# EAGLE schematic DRS_Paste_Mask (EAGLE 9.4.1)

## Sheet 1 of 4
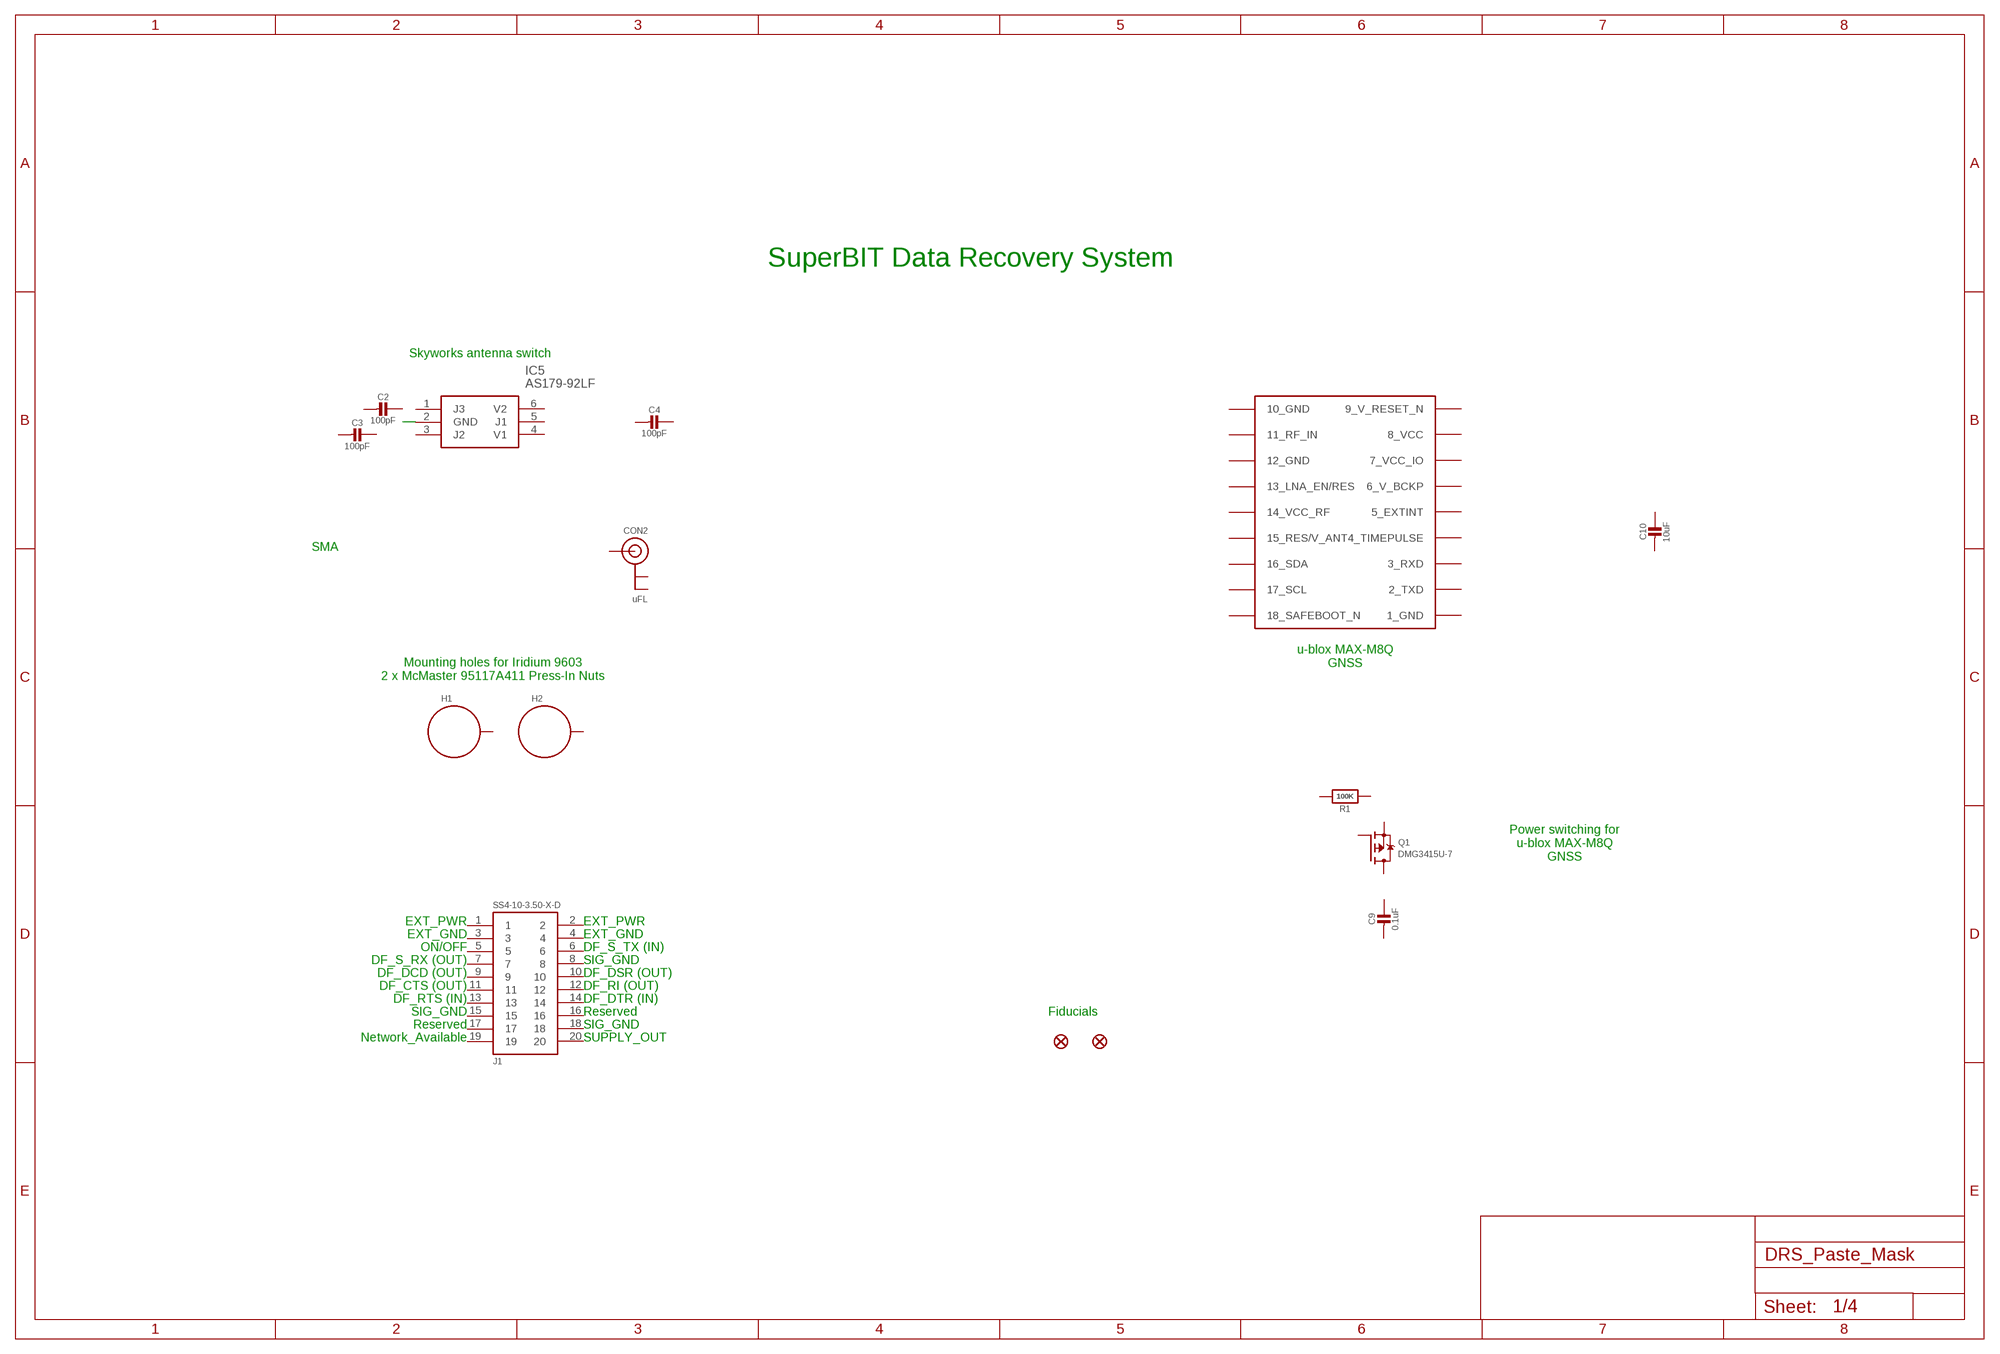
[diagram p0: schematic, sheet 1]

### Parts
C2  100pF  CAP_CERAMIC0603_NO  [0603-NO@1]
C3  100pF  CAP_CERAMIC0603_NO  [0603-NO@1]
C4  100pF  CAP_CERAMIC0603_NO  [0603-NO@1]
C9  0.1uF  CAP_CERAMIC0805-NOOUTLINE  [0805-NO@1]
C10  10uF  CAP_CERAMIC0805-NOOUTLINE  [0805-NO@1]
CON2  uFL  ANTENNA_U.FL  [U.FL]
FD1  FIDUCIAL1X2  [FIDUCIAL-1X2]
FD2  FIDUCIAL1X2  [FIDUCIAL-1X2]
H1  STANDOFF_ELECTRICALMCMASTER-95117A411  [STANDOFF-ELECTRICAL-MCMASTER-95117A411]
H2  STANDOFF_ELECTRICALMCMASTER-95117A411  [STANDOFF-ELECTRICAL-MCMASTER-95117A411]
IC5  AS179-92LF  [SOT65P220X100-6N]
IC6  MAX-M8  [MAX-M8]
J1  SS4-10-3.50-X-D  [SS4-10-3.50-X-D]
Q1  DMG3415U-7  MOSFET-PWIDE  [SOT23-WIDE]
R1  100K  RESISTOR0805_NOOUTLINE  [0805-NO]

### Nets
N$4: IC5.2(GND)
Unconnected: C2.1 C2.2 C3.1 C3.2 C4.1 C4.2 C9.1 C9.2 C10.1 C10.2 CON2.1(GND) CON2.2(GND) CON2.3(SIGNAL) H1.P1 H2.P1 IC5.1(J3) IC5.3(J2) IC5.4(V1) IC5.5(J1) IC5.6(V2) IC6.2_TXD IC6.3_RXD IC6.4_TIMEPULSE IC6.5_EXTINT IC6.6_V_BCKP IC6.11_RF_IN IC6.13_LNA_EN(13_LNA_EN/RES) IC6.14_VCC_RF IC6.15_V_ANT/RESERVED(15_RES/V_ANT) IC6.16_SDA IC6.17_SCL IC6.18_SAFEBOOT_N J1.1 J1.2 J1.3 J1.4 J1.5 J1.6 J1.7 J1.8 J1.9 J1.10 J1.11 J1.12 J1.13 J1.14 J1.15 J1.16 J1.17 J1.18 J1.19 J1.20 Q1.1(G) Q1.2(S) Q1.3(D) R1.1 R1.2

### Notes on the sheet
- SuperBIT Data Recovery System
- Skyworks antenna switch
- SMA
- u-blox MAX-M8Q
  GNSS
- Mounting holes for Iridium 9603
  2 x McMaster 95117A411 Press-In Nuts
- Power switching for
  u-blox MAX-M8Q
  GNSS
- EXT_PWR | EXT_PWR
- EXT_GND | EXT_GND
- ON/OFF | DF_S_TX (IN)
- DF_S_RX (OUT) | SIG_GND
- DF_DCD (OUT) | DF_DSR (OUT)
- DF_CTS (OUT) | DF_RI (OUT)
- DF_RTS (IN) | DF_DTR (IN)
- SIG_GND | Reserved | Fiducials
- Reserved | SIG_GND
- Network_Available | SUPPLY_OUT

## Sheet 2 of 4
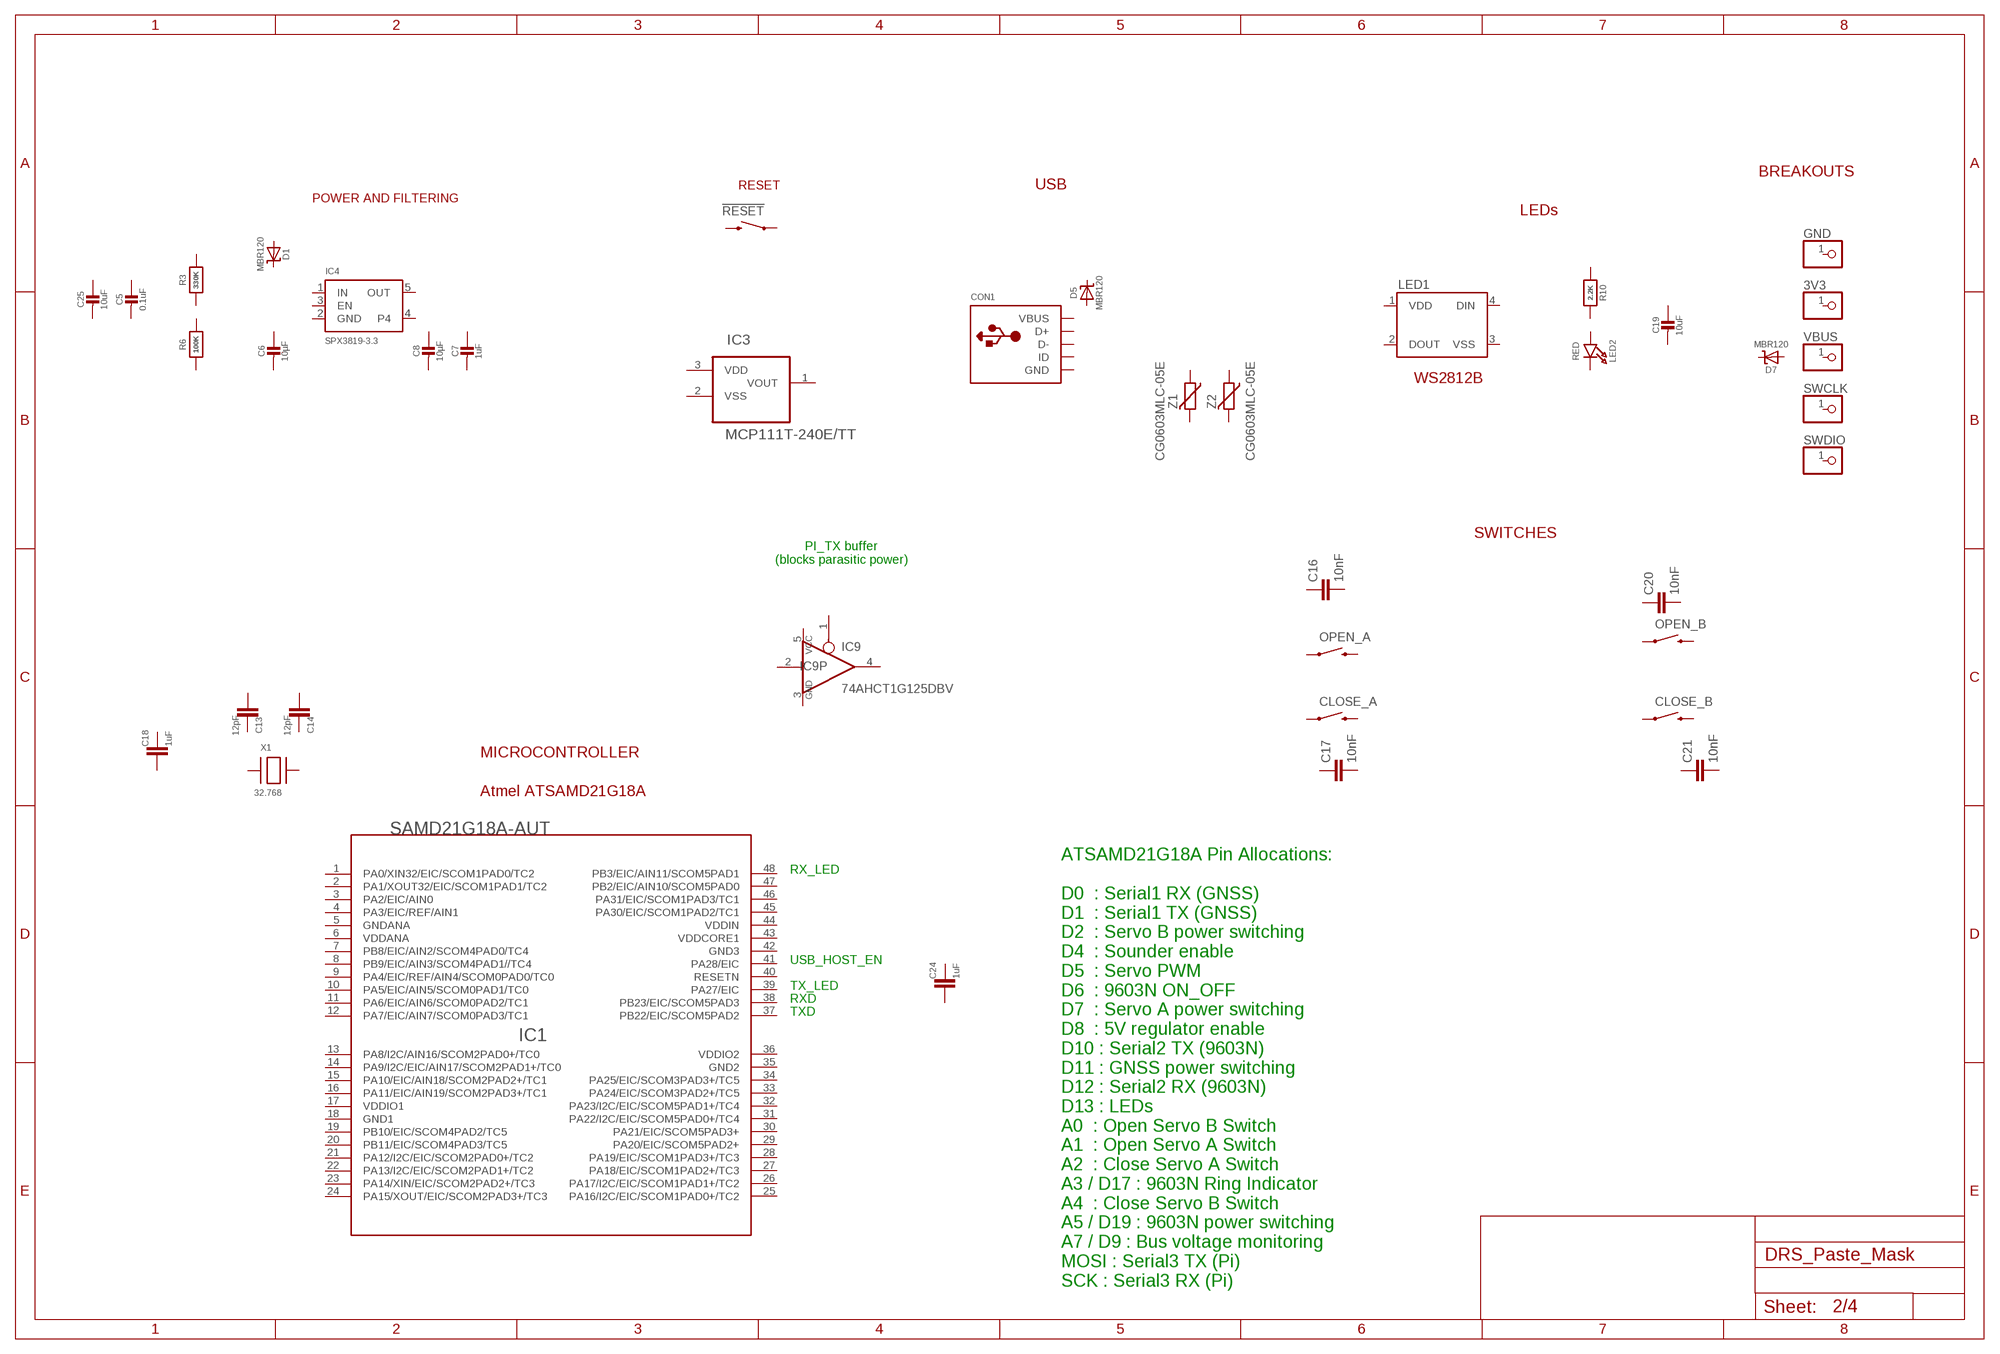
[diagram p1: schematic, sheet 2]

### Parts
3V3  PINHD-1X1  [1X01]
!RESET  SWITCH-MOMENTARY-2PTH  [TACTILE-PTH]
C5  0.1uF  CAP_CERAMIC0805-NOOUTLINE  [0805-NO@1]
C6  10µF  CAP_CERAMIC0805-NOOUTLINE  [0805-NO@1]
C7  1uF  CAP_CERAMIC0603_NO  [0603-NO@1]
C8  10µF  CAP_CERAMIC0805-NOOUTLINE  [0805-NO@1]
C13  12pF  C-EUC0603  [C0603]
C14  12pF  C-EUC0603  [C0603]
C16  10nF  C-EUC0805  [C0805]
C17  10nF  C-EUC0805  [C0805]
C18  1uF  C-EUC0603  [C0603]
C19  10uF  CAP_CERAMIC0805-NOOUTLINE  [0805-NO@1]
C20  10nF  C-EUC0805  [C0805]
C21  10nF  C-EUC0805  [C0805]
C24  1uF  C-EUC0603  [C0603]
C25  10uF  CAP_CERAMIC0805-NOOUTLINE  [0805-NO@1]
CLOSE_A  SWITCH-MOMENTARY-2PTH  [TACTILE-PTH]
CLOSE_B  SWITCH-MOMENTARY-2PTH  [TACTILE-PTH]
CON1  MICROBUILDER_USBFCI_10103594_CORRECTED  [MICROBUILDER_FCI_10103594_CORRECTED]
D1  MBR120  DIODE-SCHOTTKYSOD-123  [SOD-123]
D5  MBR120  DIODE-SCHOTTKYSOD-123  [SOD-123]
D7  MBR120  DIODE-SCHOTTKYSOD-123  [SOD-123]
GND  PINHD-1X1  [1X01]
IC1  SAMD21G18A-AUT  1792_SAMD21G18A-AUT  [TQFP48-7X7]
IC3  MCP111T-240E/TT  MCP111T-270E/TT  [SOT95P237X112-3N]
IC4  SPX3819-3.3  VREG_SOT23-5  [SOT23-5]
IC9  74AHCT1G125DBV  [SOT23-5]
LED1  WS2812B  [WS2812B]
LED2  RED  LED0805_NOOUTLINE  [CHIPLED_0805_NOOUTLINE]
OPEN_A  SWITCH-MOMENTARY-2PTH  [TACTILE-PTH]
OPEN_B  SWITCH-MOMENTARY-2PTH  [TACTILE-PTH]
R3  330K  RESISTOR0805_NOOUTLINE  [0805-NO]
R6  100K  RESISTOR0805_NOOUTLINE  [0805-NO]
R10  2.2K  RESISTOR_0603_NOOUT  [0603-NO]
SWCLK  PINHD-1X1  [1X01]
SWDIO  PINHD-1X1  [1X01]
VBUS  PINHD-1X1  [1X01]
X1  32.768  XTAL-3.2X1.5  [XTAL3215]
Z1  CG0603MLC-05E  0010_BRNCG0603MLC-05E  [CT/CN0603]
Z2  CG0603MLC-05E  0010_BRNCG0603MLC-05E  [CT/CN0603]
Unconnected: 3V3.1 !RESET.1 !RESET.3 C5.1 C5.2 C6.1 C6.2 C7.1 C7.2 C8.1 C8.2 C13.1 C13.2 C14.1 C14.2 C16.1 C16.2 C17.1 C17.2 C18.1 C18.2 C19.1 C19.2 C20.1 C20.2 C21.1 C21.2 C24.1 C24.2 C25.1 C25.2 CLOSE_A.1 CLOSE_A.3 CLOSE_B.1 CLOSE_B.3 CON1.D+ CON1.D- CON1.ID D1.A D1.C D5.A D5.C D7.A D7.C GND.1 IC1.1(PA0/XIN32/EIC/SCOM1PAD0/TC2) IC1.2(PA1/XOUT32/EIC/SCOM1PAD1/TC2) IC1.3(PA2/EIC/AIN0) IC1.4(PA3/EIC/REF/AIN1) IC1.7(PB8/EIC/AIN2/SCOM4PAD0/TC4) IC1.8(PB9/EIC/AIN3/SCOM4PAD1//TC4) IC1.9(PA4/EIC/REF/AIN4/SCOM0PAD0/TC0) IC1.10(PA5/EIC/AIN5/SCOM0PAD1/TC0) IC1.11(PA6/EIC/AIN6/SCOM0PAD2/TC1) IC1.12(PA7/EIC/AIN7/SCOM0PAD3/TC1) IC1.13(PA8/I2C/AIN16/SCOM2PAD0+/TC0) IC1.14(PA9/I2C/EIC/AIN17/SCOM2PAD1+/TC0) IC1.15(PA10/EIC/AIN18/SCOM2PAD2+/TC1) IC1.16(PA11/EIC/AIN19/SCOM2PAD3+/TC1) IC1.19(PB10/EIC/SCOM4PAD2/TC5) IC1.20(PB11/EIC/SCOM4PAD3/TC5) IC1.21(PA12/I2C/EIC/SCOM2PAD0+/TC2) IC1.22(PA13/I2C/EIC/SCOM2PAD1+/TC2) IC1.23(PA14/XIN/EIC/SCOM2PAD2+/TC3) IC1.24(PA15/XOUT/EIC/SCOM2PAD3+/TC3) IC1.25(PA16/I2C/EIC/SCOM1PAD0+/TC2) IC1.26(PA17/I2C/EIC/SCOM1PAD1+/TC2) IC1.27(PA18/EIC/SCOM1PAD2+/TC3) IC1.28(PA19/EIC/SCOM1PAD3+/TC3) IC1.29(PA20/EIC/SCOM5PAD2+) IC1.30(PA21/EIC/SCOM5PAD3+) IC1.31(PA22/I2C/EIC/SCOM5PAD0+/TC4) IC1.32(PA23/I2C/EIC/SCOM5PAD1+/TC4) IC1.33(PA24/EIC/SCOM3PAD2+/TC5) IC1.34(PA25/EIC/SCOM3PAD3+/TC5) IC1.37(PB22/EIC/SCOM5PAD2) IC1.38(PB23/EIC/SCOM5PAD3) IC1.39(PA27/EIC) IC1.40(RESETN) IC1.41(PA28/EIC) IC1.43(VDDCORE1) IC1.45(PA30/EIC/SCOM1PAD2/TC1) IC1.46(PA31/EIC/SCOM1PAD3/TC1) IC1.47(PB2/EIC/AIN10/SCOM5PAD0) IC1.48(PB3/EIC/AIN11/SCOM5PAD1) IC3.1(VOUT) IC4.3(EN) IC4.4 IC4.5(OUT) IC9.1(OE) IC9.2(I) IC9.4(O) LED1.2(DOUT) LED1.4(DIN) LED2.A LED2.C OPEN_A.1 OPEN_A.3 OPEN_B.1 OPEN_B.3 R3.1 R3.2 R6.1 R6.2 R10.1 R10.2 SWCLK.1 SWDIO.1 VBUS.1 X1.P$1 X1.P$2 Z1.1 Z1.2 Z2.1 Z2.2

### Notes on the sheet
- BREAKOUTS
- RESET | USB
- POWER AND FILTERING
- LEDs
- WS2812B
- SWITCHES
- PI_TX buffer
  (blocks parasitic power)
- MICROCONTROLLER
- Atmel ATSAMD21G18A
- ATSAMD21G18A Pin Allocations:
  
  D0  : Serial1 RX (GNSS)
  D1  : Serial1 TX (GNSS)
  D2  : Servo B power switching
  D4  : Sounder enable
  D5  : Servo PWM
  D6  : 9603N ON_OFF
  D7  : Servo A power switching
  D8  : 5V regulator enable
  D10 : Serial2 TX (9603N)
  D11 : GNSS power switching
  D12 : Serial2 RX (9603N)
  D13 : LEDs
  A0  : Open Servo B Switch
  A1  : Open Servo A Switch
  A2  : Close Servo A Switch
  A3 / D17 : 9603N Ring Indicator
  A4  : Close Servo B Switch
  A5 / D19 : 9603N power switching
  A7 / D9 : Bus voltage monitoring
  MOSI : Serial3 TX (Pi)
  SCK : Serial3 RX (Pi)
- RX_LED
- USB_HOST_EN
- TX_LED
- RXD
- TXD

## Sheet 3 of 4
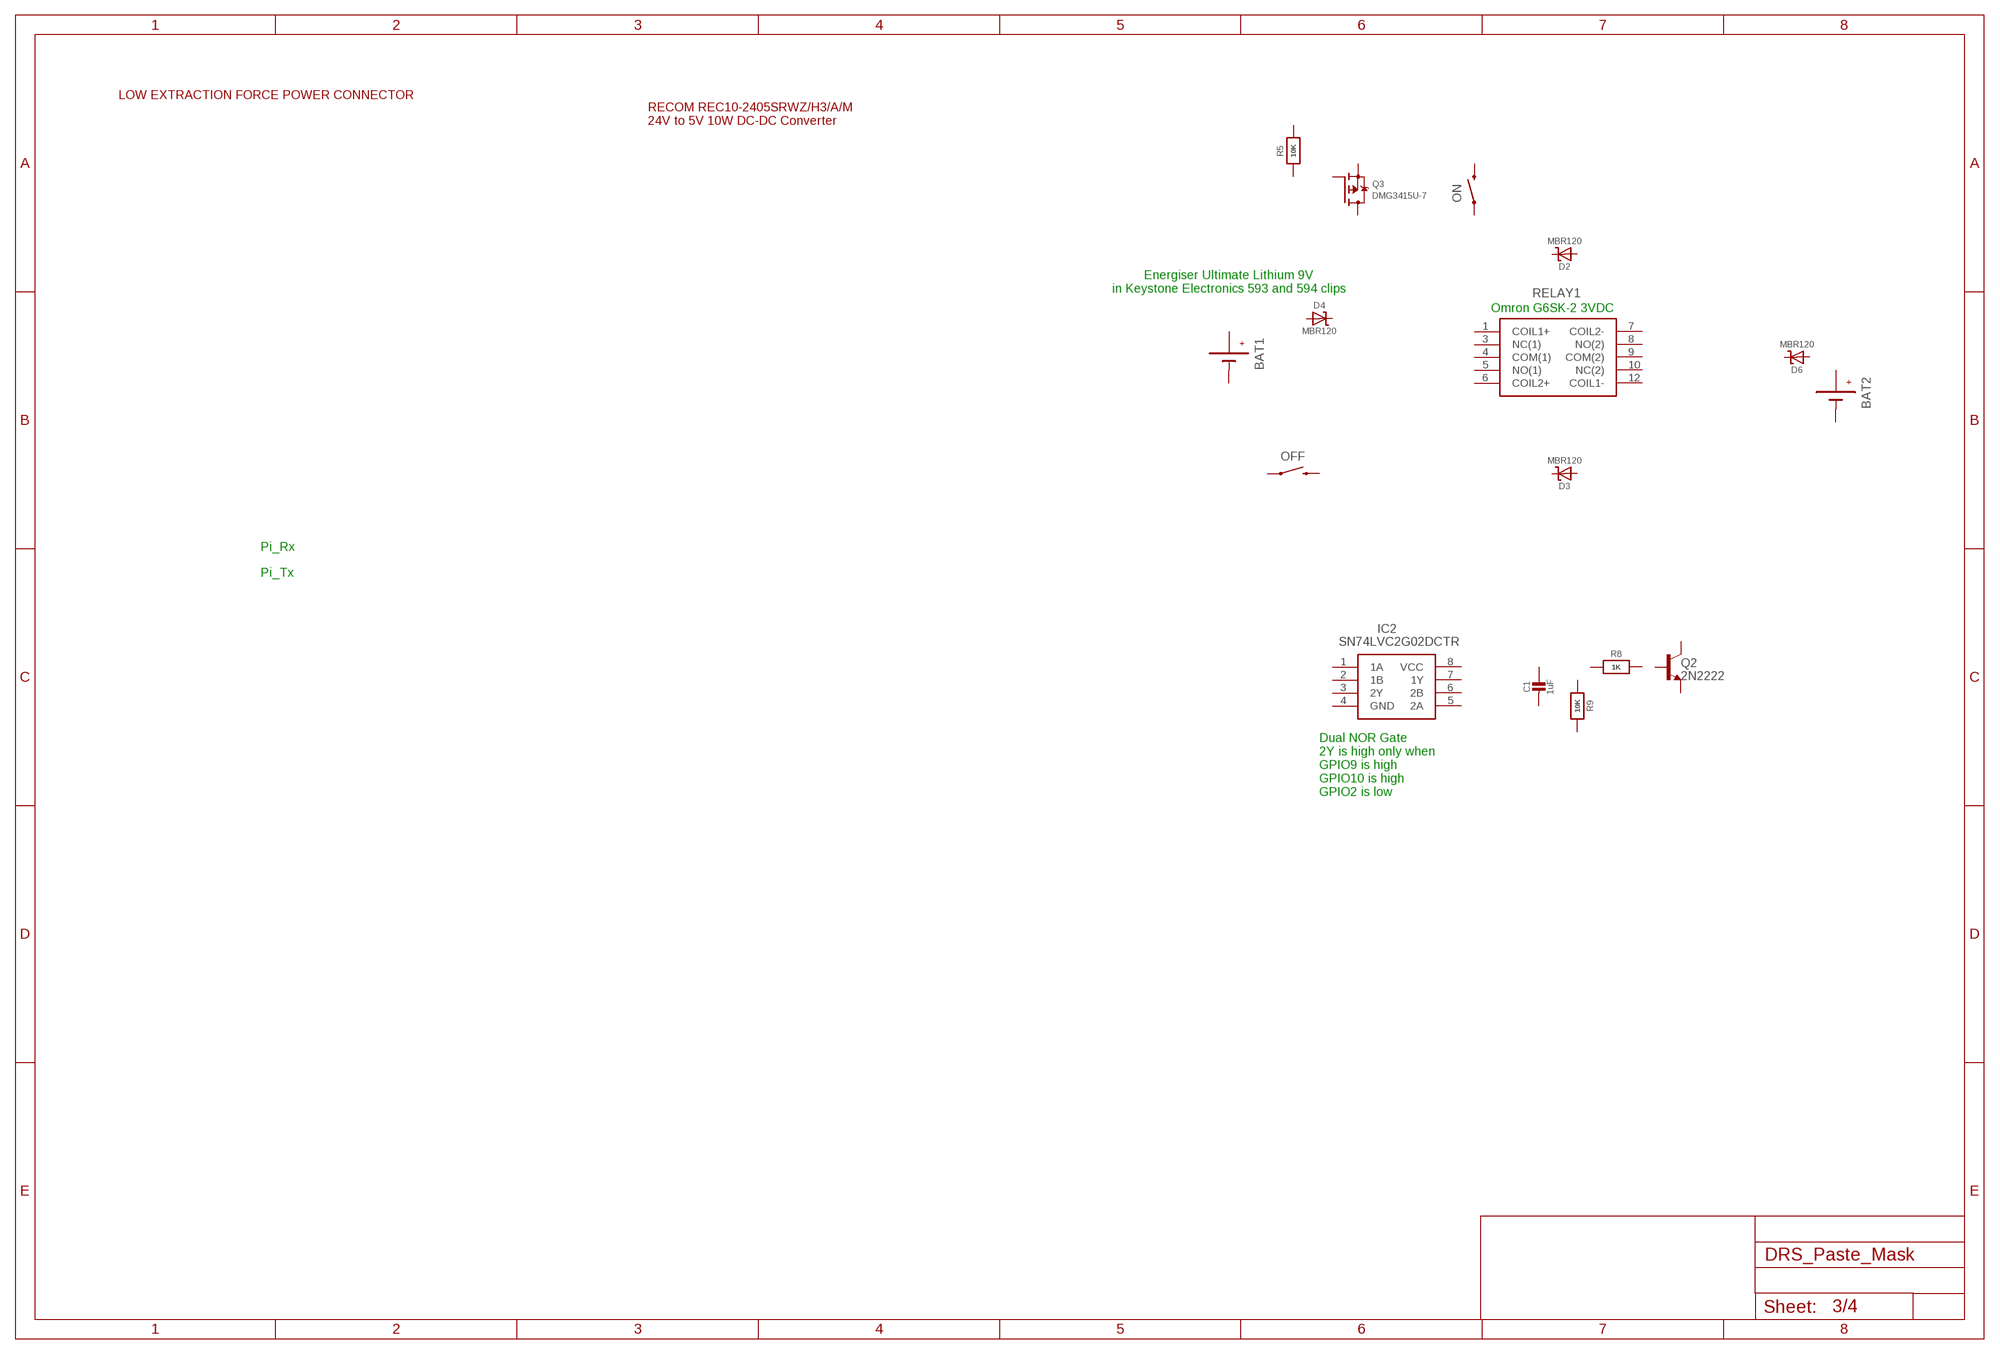
[diagram p2: schematic, sheet 3]

### Parts
BAT1  BATTERYBATTERY-9V-KEYSTONE-593-594  [BATTERY-9V-KEYSTONE-593-594]
BAT2  BATTERYBATTERY-9V-KEYSTONE-593-594  [BATTERY-9V-KEYSTONE-593-594]
C1  1uF  CAP_CERAMIC0603_NO  [0603-NO@1]
D2  MBR120  DIODE-SCHOTTKYSOD-123  [SOD-123]
D3  MBR120  DIODE-SCHOTTKYSOD-123  [SOD-123]
D4  MBR120  DIODE-SCHOTTKYSOD-123  [SOD-123]
D6  MBR120  DIODE-SCHOTTKYSOD-123  [SOD-123]
IC2  SN74LVC2G02DCTR  [SOP65P400X130-8N]
OFF  SWITCH-MOMENTARY-2PTH  [TACTILE-PTH]
ON  SWITCH-MOMENTARY-2PTH  [TACTILE-PTH]
Q2  2N2222  MMBT2222ALT1-NPN-SOT23-BEC  [SOT23-BEC]
Q3  DMG3415U-7  MOSFET-PWIDE  [SOT23-WIDE]
R5  10K  RESISTOR0805_NOOUTLINE  [0805-NO]
R8  1K  RESISTOR_0603_NOOUT  [0603-NO]
R9  10K  RESISTOR_0603_NOOUT  [0603-NO]
RELAY1  G6SK-2_DC5  [G6SK2DC5]
Unconnected: C1.1 C1.2 D2.A D2.C D3.A D3.C D4.A D4.C D6.A D6.C IC2.1(1A) IC2.2(1B) IC2.3(2Y) IC2.4(GND) IC2.5(2A) IC2.6(2B) IC2.7(1Y) IC2.8(VCC) OFF.1 OFF.3 ON.1 ON.3 Q2.B Q2.C Q2.E Q3.1(G) Q3.2(S) Q3.3(D) R5.1 R5.2 R8.1 R8.2 R9.1 R9.2 RELAY1.1(COIL1+) RELAY1.3(NC(1)) RELAY1.4(COM(1)) RELAY1.5(NO(1)) RELAY1.6(COIL2+) RELAY1.7(COIL2-) RELAY1.8(NO(2)) RELAY1.9(COM(2)) RELAY1.10(NC(2)) RELAY1.12(COIL1-)

### Notes on the sheet
- LOW EXTRACTION FORCE POWER CONNECTOR
- RECOM REC10-2405SRWZ/H3/A/M
  24V to 5V 10W DC-DC Converter
- Energiser Ultimate Lithium 9V
  in Keystone Electronics 593 and 594 clips
- Omron G6SK-2 3VDC
- Pi_Rx
- Pi_Tx
- Dual NOR Gate
  2Y is high only when
  GPIO9 is high
  GPIO10 is high
  GPIO2 is low

## Sheet 4 of 4
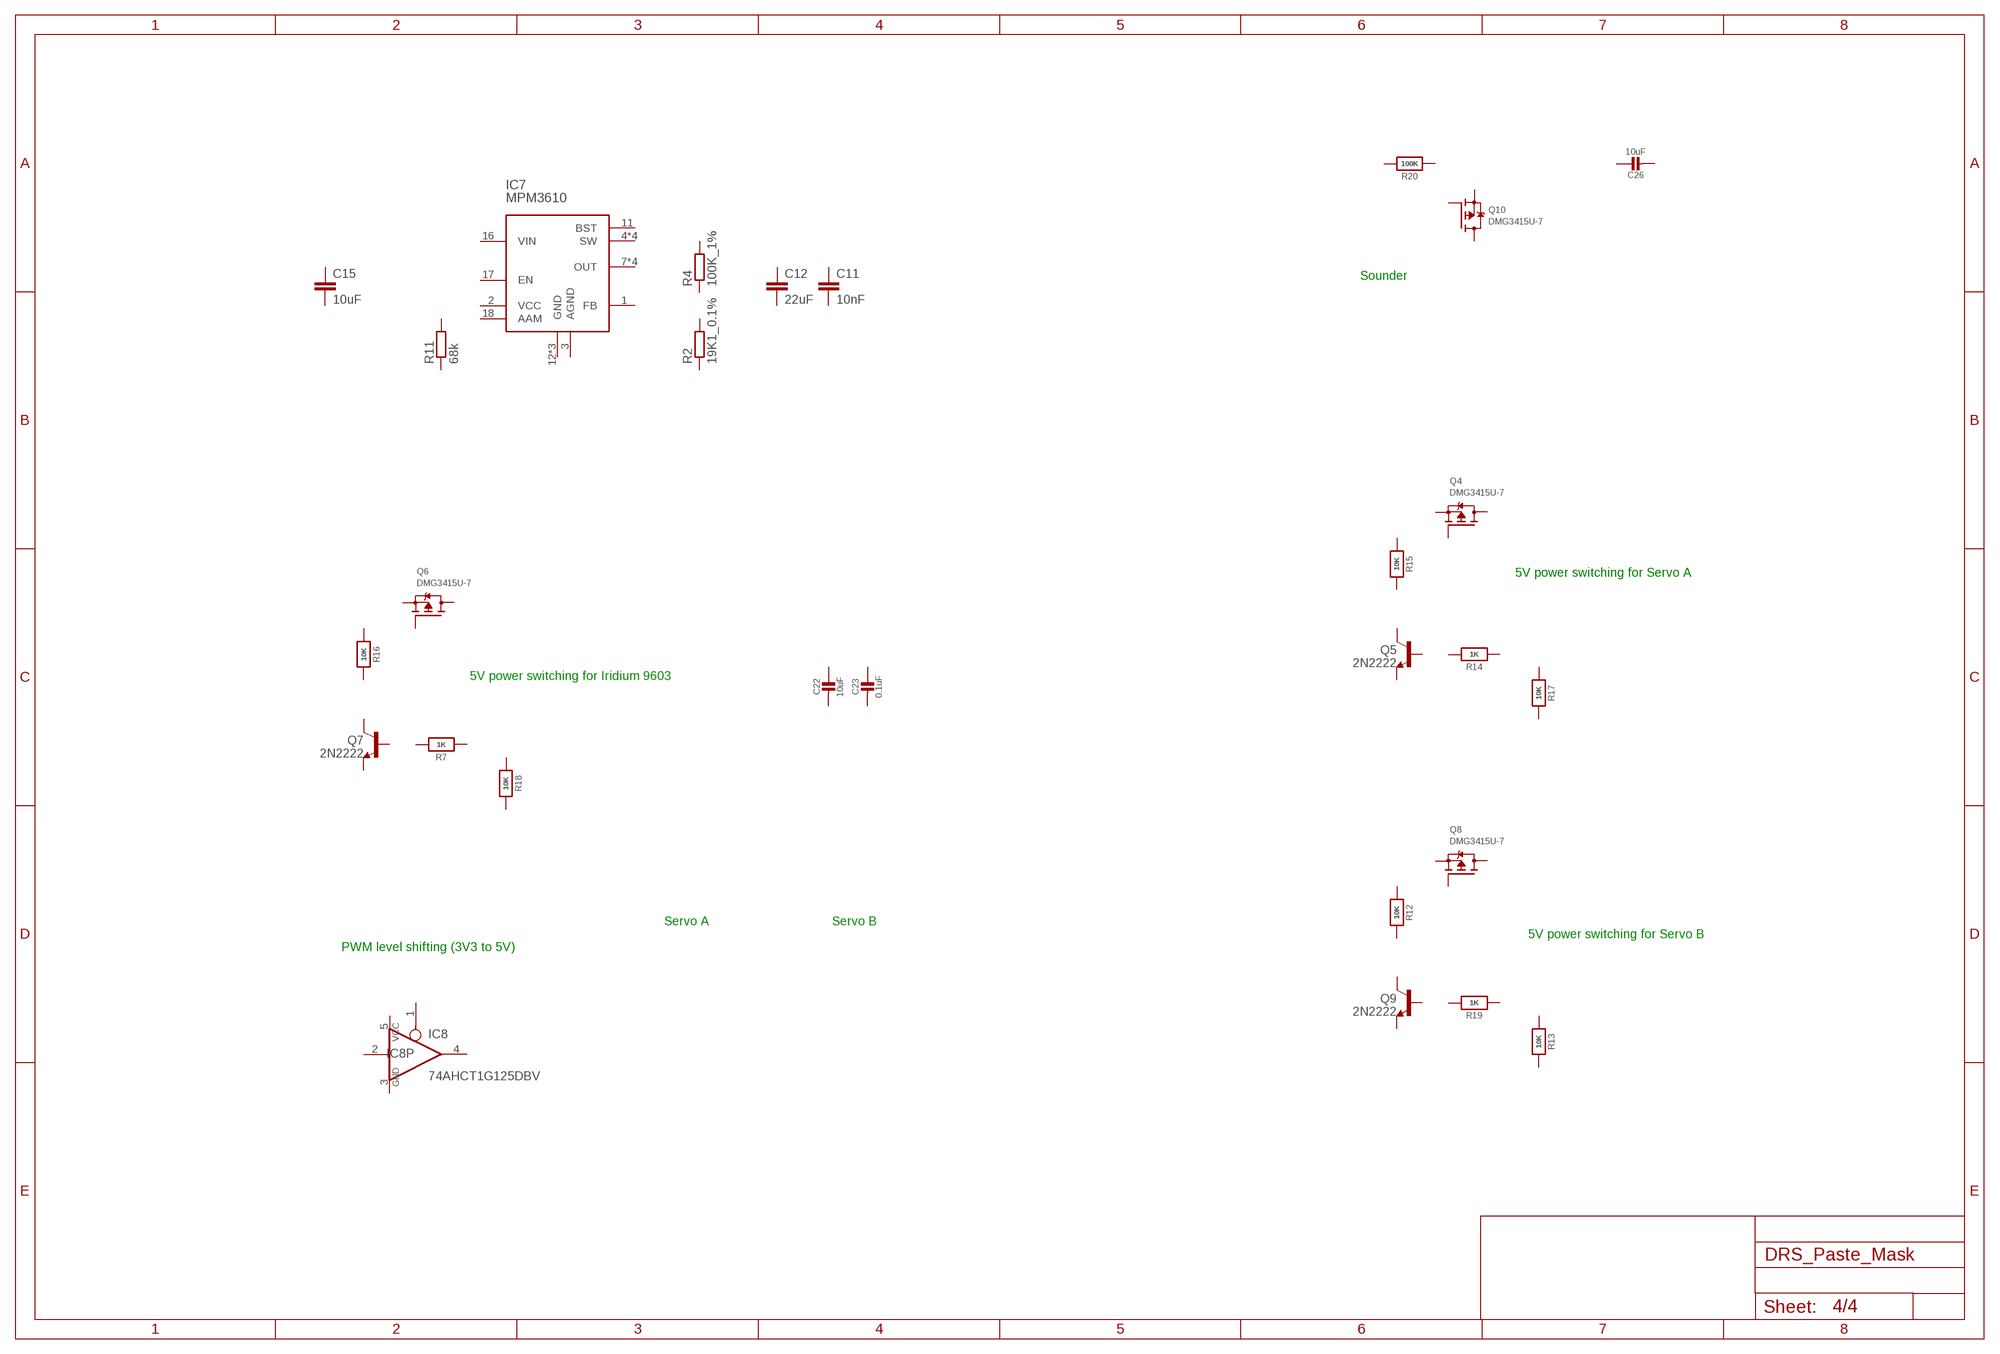
[diagram p3: schematic, sheet 4]

### Parts
C11  10nF  C-EUC0805  [C0805]
C12  22uF  C-EUC0805  [C0805]
C15  10uF  C-EUC0805  [C0805]
C22  10uF  CAP_CERAMIC0805-NOOUTLINE  [0805-NO@1]
C23  0.1uF  CAP_CERAMIC0805-NOOUTLINE  [0805-NO@1]
C26  10uF  CAP_CERAMIC0805-NOOUTLINE  [0805-NO@1]
IC7  MPM3610  2093_MPM3610GQV-P  [QFN-20]
IC8  74AHCT1G125DBV  [SOT23-5]
Q4  DMG3415U-7  MOSFET-PWIDE  [SOT23-WIDE]
Q5  2N2222  MMBT2222ALT1-NPN-SOT23-BEC  [SOT23-BEC]
Q6  DMG3415U-7  MOSFET-PWIDE  [SOT23-WIDE]
Q7  2N2222  MMBT2222ALT1-NPN-SOT23-BEC  [SOT23-BEC]
Q8  DMG3415U-7  MOSFET-PWIDE  [SOT23-WIDE]
Q9  2N2222  MMBT2222ALT1-NPN-SOT23-BEC  [SOT23-BEC]
Q10  DMG3415U-7  MOSFET-PWIDE  [SOT23-WIDE]
R2  19K1_0.1%  R-EU_R0805  [R0805]
R4  100K_1%  R-EU_R0805  [R0805]
R7  1K  RESISTOR_0603_NOOUT  [0603-NO]
R11  68k  R-EU_R0805  [R0805]
R12  10K  RESISTOR_0603_NOOUT  [0603-NO]
R13  10K  RESISTOR_0603_NOOUT  [0603-NO]
R14  1K  RESISTOR_0603_NOOUT  [0603-NO]
R15  10K  RESISTOR_0603_NOOUT  [0603-NO]
R16  10K  RESISTOR_0603_NOOUT  [0603-NO]
R17  10K  RESISTOR_0603_NOOUT  [0603-NO]
R18  10K  RESISTOR_0603_NOOUT  [0603-NO]
R19  1K  RESISTOR_0603_NOOUT  [0603-NO]
R20  100K  RESISTOR0805_NOOUTLINE  [0805-NO]
Unconnected: C11.1 C11.2 C12.1 C12.2 C15.1 C15.2 C22.1 C22.2 C23.1 C23.2 C26.1 C26.2 IC7.1(FB) IC7.2(VCC) IC7.3(AGND) IC7.4(SW) IC7.5(SW) IC7.6(SW) IC7.7(OUT) IC7.8(OUT) IC7.9(OUT) IC7.11(BST) IC7.12(GND) IC7.13(GND) IC7.14(GND) IC7.16(VIN) IC7.17(EN) IC7.18(AAM) IC7.19(SW) IC7.20(OUT) IC8.1(OE) IC8.2(I) IC8.4(O) Q4.1(G) Q4.2(S) Q4.3(D) Q5.B Q5.C Q5.E Q6.1(G) Q6.2(S) Q6.3(D) Q7.B Q7.C Q7.E Q8.1(G) Q8.2(S) Q8.3(D) Q9.B Q9.C Q9.E Q10.1(G) Q10.2(S) Q10.3(D) R2.1 R2.2 R4.1 R4.2 R7.1 R7.2 R11.1 R11.2 R12.1 R12.2 R13.1 R13.2 R14.1 R14.2 R15.1 R15.2 R16.1 R16.2 R17.1 R17.2 R18.1 R18.2 R19.1 R19.2 R20.1 R20.2

### Notes on the sheet
- Sounder
- 5V power switching for Servo A
- 5V power switching for Iridium 9603
- Servo A | Servo B
- 5V power switching for Servo B
- PWM level shifting (3V3 to 5V)

## Power pins joined to a net without a drawn wire
1_GND: IC6.1_GND
7_VCC_IO: IC6.7_VCC_IO
8_VCC: IC6.8_VCC
9_V_RESET_N: IC6.9_RESET_N(9_V_RESET_N)
10_GND: IC6.10_GND
12_GND: IC6.12_GND
+: BAT1.PWR1(+) BAT1.PWR2(+) BAT1.PWR(+) BAT2.PWR1(+) BAT2.PWR2(+) BAT2.PWR(+)
-: BAT1.GND1(-) BAT1.GND2(-) BAT1.GND(-) BAT2.GND1(-) BAT2.GND2(-) BAT2.GND(-)
GND: CON1.BASE@1(GND) CON1.BASE@2(GND) CON1.GND CON1.SPRT@1(GND) CON1.SPRT@2(GND) CON1.SPRT@3(GND) CON1.SPRT@4(GND) IC4.2(GND) IC8.3(GND) IC9.3(GND)
GND1: IC1.18(GND1)
GND2: IC1.35(GND2)
GND3: IC1.42(GND3)
GNDANA: IC1.5(GNDANA)
IN: IC4.1(IN)
VBUS: CON1.VBUS
VCC: IC8.5(VCC) IC9.5(VCC)
VDD: IC3.3(VDD) LED1.1(VDD)
VDDANA: IC1.6(VDDANA)
VDDIN: IC1.44(VDDIN)
VDDIO1: IC1.17(VDDIO1)
VDDIO2: IC1.36(VDDIO2)
VSS: IC3.2(VSS) LED1.3(VSS)

## Library data of the parts
3V3 GND SWCLK SWDIO VBUS = adafruit:PINHD-1X1: Pin header 1x1 for 0.1" spacing With round pins
!RESET CLOSE_A CLOSE_B OFF ON OPEN_A OPEN_B = SparkFun-Electromechanical:SWITCH-MOMENTARY-2: Various NO switches- pushbuttons, reed, etc; PROD_ID: SWCH-08441
BAT1 BAT2 = SparkFun-Electromechanical:BATTERY: Battery Holders Various common sizes : AA, AAA, 18650 (PRT-12895), 20mm coin cell and 12mm coin cell. 20MM_4LEGS, BATT-10373
C1-C10 C19 C22 C23 C25 C26 = microbuilder:CAP_CERAMIC: Ceramic Capacitors For new designs, use the packages preceded by an '_' character since they are more reliable: The following footprints should be used on most boards: _0402 - Standard footprint for regular board layouts _0603 - Standard footprint for regular board layouts _0805 - Standard footprint for regular board layouts _1206 - Standard footprint for regular board layouts For extremely tight-pitch boards where space is at a premium, the following 'micro-pitch' footprints can be used (smaller pads, no silkscreen outline, etc.): _0402MP - Micro-pitch footprint for very dense/compact boards _0603MP - Micro-pitch footprint for very dense/compact boards _0805MP - Micro-pitch footprint for very dense/compact boards _1206MP - Micro-pitch footprint for very dense/compact boards
C11-C18 C20 C21 C24 = rcl:C-EU: CAPACITOR, European symbol; SPICEPREFIX: C
CON1 = Iridium_9603_Beacon:MICROBUILDER_USB: USB Connectors USBMINIB - Surface Mount Female Mini-B USB Connector 4UConnector: 06564
CON2 = microbuilder:ANTENNA_U.FL: U.FL Antenna Connector
D1-D7 = microbuilder:DIODE-SCHOTTKY
FD1 FD2 = SparkFun-Aesthetics:FIDUCIAL: Fiducial Alignment Points Various fiducial points for machine vision alignment.
H1 H2 = SparkFun-Electromechanical:STANDOFF_ELECTRICAL: A standoff intended to be an electrically connected point.
IC1 = IntegratedCircuits:1792_SAMD21G18A-AUT: Atmel D21 32bit ARM Cortex-M0 microcontroller - 48 PIN TQFP 256KB flash memory + 32KB SRAM
IC2 = SamacSys_Parts:SN74LVC2G02DCTR: DUAL 2-INPUT POSITIVE-NOR GATE Source: Datasheet <http://www.ti.com/lit/gpn/sn74lvc2g02>; ARROW_PART_NUMBER: SN74LVC2G02DCTR; ARROW_PRICE/STOCK: https://www.arrow.com/en/products/sn74lvc2g02dctr/texas-instruments; DESCRIPTION: DUAL 2-INPUT POSITIVE-NOR GATE; HEIGHT: mm; MANUFACTURER_NAME: Texas Instruments; MANUFACTURER_PART_NUMBER: SN74LVC2G02DCTR
IC3 = Microchip-MCP11:MCP11: Micropower Voltage Detector ,SOT23-3;; MPN: MCP111T-240E/TT; OC_FARNELL: 1851877; OC_NEWARK: 56J7328; PACKAGE: SOT23-3; SUPPLIER: MICROCHIP
IC4 = microbuilder:VREG_SOT23-5: SOT23-5 Fixed Voltage Regulators Part Current Out V Out V In V Dropout ?JA (°C/W) TJ (°C) Digikey Part No. ADP121 150mA 3.3V 3.4-5.5V 0.09V @ 150mA -- -- ADP121-AUJZ33R7CT-ND ADP121 150mA 3.0V 3.1-5.5V 0.09V @ 150mA -- -- ADP121-AUJZ30R7CT-ND ADP122 300mA 3.3V 3.4-5.5V 0.085V @ 300mA -- -- ADP122AUJZ-3.3-R7CT-ND ADP1712 300mA 3.3V 3.5-5.5V 0.17V @ 300mA -- -- ADP1712AUJZ-3.3-R7TR-ND AP7311 (Low Cost) 150mA 3.3V 3.5-6V 0.15V @ 150mA -- -- AP7311-33WG-7DICT-ND LD39015M18R 150mA 1.8V 1.9V-5.5V 0.08V @ 100mA -- -- 497-6977-1-ND LP2985A-33DBVR 150mA 3.3V 3.3-16V 0.28V @ 150mA 206 150 296-18479-1-ND MCP1824T-3302E/OT 300mA 3.3V 3.5V-6V 0.2V @ 300mA -- -- MCP1824T-3302E/OTCT-ND MIC5205-2.5YM5 TR 150mA 2.5V 2.7-16V 0.165V @ 150mA -- -- 576-1257-2-ND MIC5205-3.0YM5 TR 150mA 3.0V 3.2V-16V 0.165V @ 150mA -- -- 576-1258-2-ND MIC5205-3.3YM5 TR 150mA 3.3V 3.5V-16V 0.165V @ 150mA -- -- 576-1259-2-ND TPS780330220 150mA 3.3V+2.2V 3.6-5.5V 250mV Max -- -- 296-23332-1-ND TDA3663/N1,135 100mA 3.3V 3.5-45V 0.18V @ 50mA -- -- 568-5343-1-ND Max operating temp can be calculated using ?JA, TJ (max junction temperature), and power in watts. Set the "Maximum Ambient Temperature" until it reaches TJ ("Max Junction Temperature"), which is the absolute limit for safe use of the regulator: Heat Sink Temperature Calculator <http://www.daycounter.com/Calculators/Heat-Sink-Temperature-Calculator.phtml> For example, With 12V source into a 3.3V LP2985 and a 30mA load, we are dissipating (12V-3.3V) * 0.03A = 0.261W. With a ?JA of 206 °C/W, a TJ of 150°C, and 261mW we can safely use the chip without a heat sink up to 75°C (=147.1°C Junction Temperature).
IC5 = SamacSys_Parts:AS179-92LF: SKYWORKS SOLUTIONS - AS179-92LF - IC, SWITCH, RF, SPDT, 0.02-3.0GHZ Source: Datasheet <http://www.skyworksinc.com/uploads/documents/AS179_92LF_200176H.pdf>; ARROW_PART_NUMBER: AS179-92LF; DESCRIPTION: SKYWORKS SOLUTIONS - AS179-92LF - IC, SWITCH, RF, SPDT, 0.02-3.0GHZ; HEIGHT: 1mm; MANUFACTURER_NAME: Skyworks; MANUFACTURER_PART_NUMBER: AS179-92LF
IC6 = ubloxLib:MAX-M8: u-blox MAX GNSS module
IC7 = IntegratedCircuits:2093_MPM3610GQV-P: MPM3610 Step Down Regulator; CASE: QFN-20; PART_NUMBER: MPM3610GQV-P; TYPE: Circuito_Integrato
IC8 IC9 = 74xx-little-us:74*1G125: Single Bus Buffer Gate with 3-State Output
J1 = SS4-10-3.50-X-D:SS4-10-3.50-X-D: 0.4mm[.016] SOCKET STRIP ASSEMBLY.
LED1 = SparkFun-LED:WS2812B: WS2812B - Intelligent control LED integrated light source Technical Specifications: Power Supply Voltage (VDD): 3.5 to 5.3 V Input Voltage (VI): -0.5 to VDD+0.5 V Operating Junction Temperature (Topt): -25°C to +80°C Storage Temperature Range (Tstg): -55°C to +150°C; PROD_ID: DIO-12503
LED2 = microbuilder:LED: LED 0603 - 0603 Surface Mount Package 2mA: Green LED - Low Power (3.9mcd, 2ma, 1.7Vf) - Digikey: 475-2709-2-ND Orange LED - Low Power (9.8mcd, 2ma, 1.8Vf) - Digikey: 475-1194-2-ND Red LED - Low Power (5mcd, 2ma, 1.8Vf) - Digikey: 475-1195-2-ND Yellow LED - Low Power (7mcd, 2ma, 1.8Vf) - Digikey: 475-1196-2-ND 5mA: Blue LED - Low Power (17mcd, 5ma, 2.9Vf) - Digikey: LNJ937W8CRACT-ND 0805 - 0805 Surface Mount Package 2mA: Red LED (8.8mcd, 2mA, 1.8Vf, Clear) - Low Power [Digikey: 475-2510-1-ND] Green LED (5mcd, 2mA, 1.8Vf, Clear) - Low Power [Digikey: 475-2730-1-ND] Yellow LED (11.3mcd, 2mA, 1.8Vf, Clear) - Low Power [Digikey: 475-2555-1-ND] 20mA: Red LED (104mcd, 20mA, Diffused) - LS R976 [Digikey: 475-1278-6-ND] Red LED (12mcd, 20mA, 2.0Vf, Clear) - APT2012EC [Digikey: 754-1128-1-ND] Green LED (15mcd, 20mA, 2.2Vf, Clear) - APT2012GC [Digikey: 754-1131-1-ND] Orange LED (160mcd, 20mA, 2.1Vf, Clear) - APT2012SECK [Digikey: 754-1130-1-ND] 1206 - 1206 Surface Mount Package Green LED (26mcd, 20mA, Diffused) - LG N971 [Digikey: 475-1407-6-ND] Red LED (15mcd, 20mA, Diffused) - LH N974 [Digikey: 475-1416-6-ND] Cree - Cree High-Power Surface Mount LEDs XPEBWT-L1-0000-00D50 - White 111lm 350mA 2.9Vf 6200K 110° XTEAWT-00-0000-00000LEE3 - White 114lm 350mA 2.85Vf 5000K 115° Everlight - Everlight 45-21 Series Surface Mount LEDs 45-21/QK2C-B2832AC2CB2/2T - Warm White 2000mcd 20mA 3.25Vf 3050K 120° 45-21/LK2C-B38452C4CB2/2T - Nuetral White 2000mcd 20mA 3.25Vf 4150K 120° 45-21/LK2C-B50634C6CB2/2T - Cold White 2200mcd 20mA 3.25Vf 5650K 120° PLCC2 Reverse Mount LS T77K-J1L2-1-0-2-R18-Z - Red 11.25mcd 2mA 1.8Vf 630nm 120° LO T77K-L1M2-24-Z - Orange 19.6mcd 2mA 1.8Vf 606nm 120° LY T77K-K2M1-26-Z - Yellow 15.7mcd 2mA 1.8Vf 587nm 120°
Q1 Q3 Q4 Q6 Q8 Q10 = microbuilder:MOSFET-P: P-Channel Mosfet LEGEND VDS: Voltage Drain-Source ID: Drain Current RDS(ON): Drain-Source On-State Resistance VGS(TH): Gate-Source Threshold Voltage CISS: Drain-Source Input Capacitance SOT-23 Name VDS ID RDS(ON) VGS(TH) CISS Order Number IRLML5103 30V 760mA 600 mOhm -- 75pF @ 25V Digikey: IRLML5103PBFCT-ND IRLML6401 12V 4.3A 50 mOhm 950mV @ 250µA 830pF @ 10V Digikey: IRLML6401PBFTR-ND NTR0202PL 20V 400mA 800 mOhm 2.3V @ 250uA 70pF @ 5V Digikey: NTR0202PLT1GOSTR-ND NTR4101PT1G 20V 1.8A 85 mOhm 1.2V @ 250uA 675pF @ 10V Digikey: NTR4101PT1GOSCT-ND DMP2004K 20V 600mA 900 mOhm 1V @ 250uA 175pF @ 16V Digikey: DMP2004KDICT-ND PMV65XP 20V 3.9A 76 mOhm 950mV @ 1mA 725pF @ 20V Digikey: 568-2358-2-ND TO-252 Name VDS ID RDS(ON) VGS(TH) CISS Order Number AOD417 30V 25A 34 mOhm 3V @ 250µA 920pF @ 15V Digikey: 785-1106-2-ND
Q2 Q5 Q7 Q9 = transistor:*-NPN-: NPN Transistror BF959 corrected 2008.03.06
R1 R3 R5-R10 R12-R20 = microbuilder:RESISTOR: Resistors For new designs, use the packages preceded by an '_' character since they are more reliable: The following footprints should be used on most boards: _0402 - Standard footprint for regular board layouts _0603 - Standard footprint for regular board layouts _0805 - Standard footprint for regular board layouts _1206 - Standard footprint for regular board layouts For extremely tight-pitch boards where space is at a premium, the following 'micro-pitch' footprints can be used (smaller pads, no silkscreen outline, etc.): _0402MP - Micro-pitch footprint for very dense/compact boards _0603MP - Micro-pitch footprint for very dense/compact boards _0805MP - Micro-pitch footprint for very dense/compact boards _1206MP - Micro-pitch footprint for very dense/compact boards
R2 R4 R11 = rcl:R-EU_: RESISTOR, European symbol; SPICEPREFIX: R
RELAY1 = G6SK-2_DC5:G6SK-2_DC5: RELAY TELECOM DPDT 2A 5V Source: Datasheet <http://omronfs.omron.com/en_US/ecb/products/pdf/en-g6s.pdf>; DESCRIPTION: RELAY TELECOM DPDT 2A 5V; HEIGHT: 9mm; MANUFACTURER_NAME: Omron Electronics; MANUFACTURER_PART_NUMBER: G6SK-2 DC5
X1 = adafruit2:XTAL: Low cost SMT crystals, no capacitors included http://www.ladyada.net/library/eagle
Z1 Z2 = Protezione:0010_BRNCG0603MLC-05E: CG0603MLC-05E; MONTHLY_USAGE: _____; PART_NUMBER: BRNCG0603MLC-05E; PRICE: _____; SUPPLIER: _____; TYPE: Protezione; VALUE: BRNCG0603MLC-05E

## Net classes
2 gnd: width 0.102 mm, drill 0.1 mm
4 USBpair: width 0.102 mm, drill 0.1 mm, clearance 0.15 mm to class 3